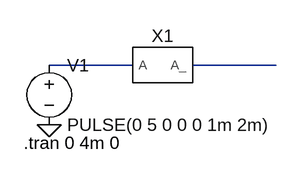
[diagram p0: schematic INVERTER_TB.asc]
INVERTER_TB.asc, the LTspice schematic file:
Version 4
SHEET 1 880 680
WIRE 144 144 32 144
WIRE 336 144 224 144
FLAG 32 224 0
SYMBOL INVERT 176 144 R0
SYMATTR InstName X1
SYMBOL voltage 32 128 R0
WINDOW 123 0 0 Left 0
WINDOW 39 0 0 Left 0
SYMATTR InstName V1
SYMATTR Value PULSE(0 5 0 0 0 1m 2m)
TEXT -2 248 Left 2 !.tran 0 4m 0

The netlist it stands for:
* INVERTER_TB.asc
XX1 N001 N002 INVERT  ; pins A A_
V1 N001 0 PULSE(0 5 0 0 0 1m 2m)
.tran 0 4m 0
.backanno
.end